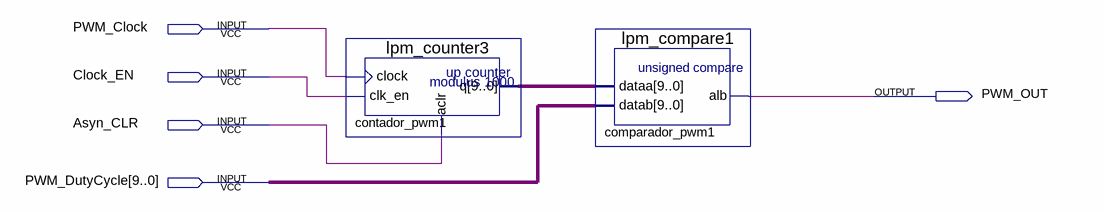
[diagram p0: schematic sheet]
// Quartus schematic PWMGenerator.bdf as structural Verilog: 2 symbols, 5 pins
module PWMGenerator (
  input  PWM_Clock,
  input  Clock_EN,
  input  Asyn_CLR,
  input  [9:0] PWM_DutyCycle,
  output PWM_OUT
);

  wire [9:0] contador_pwm1_q;

  lpm_counter3 contador_pwm1 (.clock(PWM_Clock), .clk_en(Clock_EN), .aclr(Asyn_CLR), .q(contador_pwm1_q));
  lpm_compare1 comparador_pwm1 (.dataa(contador_pwm1_q), .datab(PWM_DutyCycle), .alb(PWM_OUT));
endmodule
